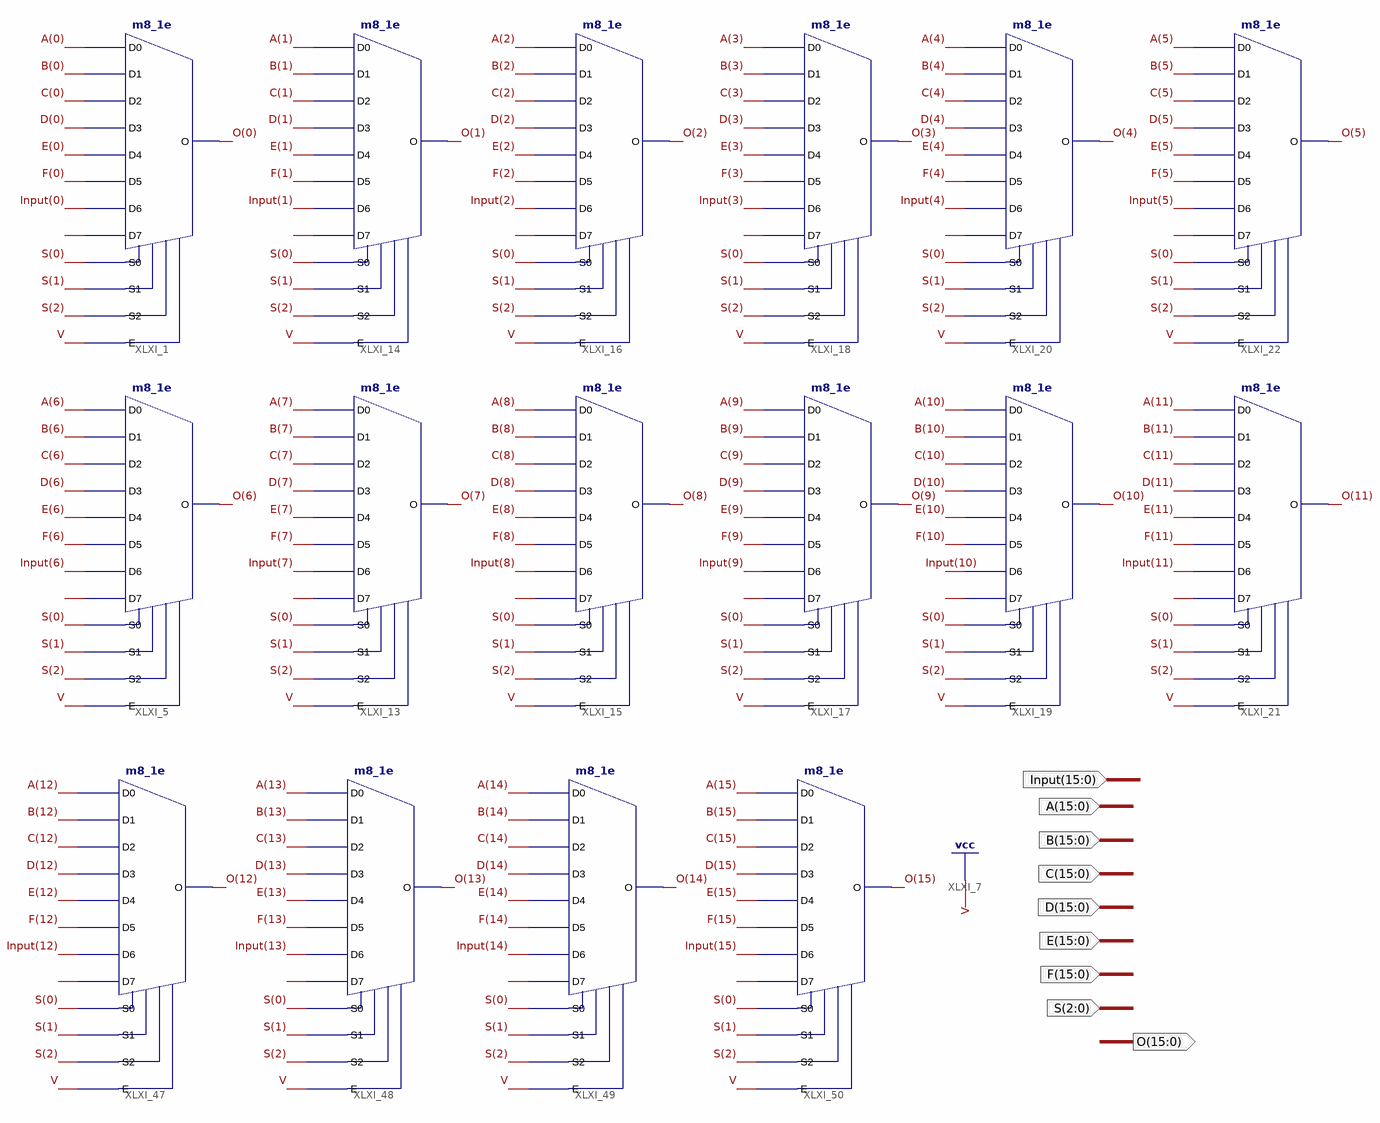
[diagram p0: schematic sheet 1]
// Xilinx ISE schematic mux6input16bit.sch (spartan3adsp) as structural Verilog: 16 symbols, 9 ports
module mux6input16bit (
  input  [15:0] A,
  input  [15:0] B,
  input  [15:0] C,
  input  [15:0] D,
  input  [15:0] E,
  input  [15:0] F,
  input  [2:0] S,
  input  [15:0] Input,
  output [15:0] O
);

  wire XLXN_13, XLXN_86, XLXN_190, XLXN_203, XLXN_216, XLXN_229, XLXN_242, XLXN_255, XLXN_268, XLXN_281,
       XLXN_294, XLXN_307, XLXN_632, XLXN_645, XLXN_658, XLXN_671;

  m8_1e XLXI_5 (
    .D0(A[6]), .D1(B[6]), .D2(C[6]), .D3(D[6]), .D4(E[6]), .D5(F[6]), .D6(Input[6]), .D7(XLXN_86), .E(1'b1),
    .S0(S[0]), .S1(S[1]), .S2(S[2]), .O(O[6]));
  m8_1e XLXI_1 (
    .D0(A[0]), .D1(B[0]), .D2(C[0]), .D3(D[0]), .D4(E[0]), .D5(F[0]), .D6(Input[0]), .D7(XLXN_13), .E(1'b1),
    .S0(S[0]), .S1(S[1]), .S2(S[2]), .O(O[0]));
  m8_1e XLXI_13 (
    .D0(A[7]), .D1(B[7]), .D2(C[7]), .D3(D[7]), .D4(E[7]), .D5(F[7]), .D6(Input[7]), .D7(XLXN_190), .E(1'b1),
    .S0(S[0]), .S1(S[1]), .S2(S[2]), .O(O[7]));
  m8_1e XLXI_14 (
    .D0(A[1]), .D1(B[1]), .D2(C[1]), .D3(D[1]), .D4(E[1]), .D5(F[1]), .D6(Input[1]), .D7(XLXN_203), .E(1'b1),
    .S0(S[0]), .S1(S[1]), .S2(S[2]), .O(O[1]));
  m8_1e XLXI_15 (
    .D0(A[8]), .D1(B[8]), .D2(C[8]), .D3(D[8]), .D4(E[8]), .D5(F[8]), .D6(Input[8]), .D7(XLXN_216), .E(1'b1),
    .S0(S[0]), .S1(S[1]), .S2(S[2]), .O(O[8]));
  m8_1e XLXI_16 (
    .D0(A[2]), .D1(B[2]), .D2(C[2]), .D3(D[2]), .D4(E[2]), .D5(F[2]), .D6(Input[2]), .D7(XLXN_229), .E(1'b1),
    .S0(S[0]), .S1(S[1]), .S2(S[2]), .O(O[2]));
  m8_1e XLXI_17 (
    .D0(A[9]), .D1(B[9]), .D2(C[9]), .D3(D[9]), .D4(E[9]), .D5(F[9]), .D6(Input[9]), .D7(XLXN_242), .E(1'b1),
    .S0(S[0]), .S1(S[1]), .S2(S[2]), .O(O[9]));
  m8_1e XLXI_18 (
    .D0(A[3]), .D1(B[3]), .D2(C[3]), .D3(D[3]), .D4(E[3]), .D5(F[3]), .D6(Input[3]), .D7(XLXN_255), .E(1'b1),
    .S0(S[0]), .S1(S[1]), .S2(S[2]), .O(O[3]));
  m8_1e XLXI_19 (
    .D0(A[10]), .D1(B[10]), .D2(C[10]), .D3(D[10]), .D4(E[10]), .D5(F[10]), .D6(Input[10]), .D7(XLXN_268),
    .E(1'b1), .S0(S[0]), .S1(S[1]), .S2(S[2]), .O(O[10]));
  m8_1e XLXI_20 (
    .D0(A[4]), .D1(B[4]), .D2(C[4]), .D3(D[4]), .D4(E[4]), .D5(F[4]), .D6(Input[4]), .D7(XLXN_281), .E(1'b1),
    .S0(S[0]), .S1(S[1]), .S2(S[2]), .O(O[4]));
  m8_1e XLXI_21 (
    .D0(A[11]), .D1(B[11]), .D2(C[11]), .D3(D[11]), .D4(E[11]), .D5(F[11]), .D6(Input[11]), .D7(XLXN_294),
    .E(1'b1), .S0(S[0]), .S1(S[1]), .S2(S[2]), .O(O[11]));
  m8_1e XLXI_22 (
    .D0(A[5]), .D1(B[5]), .D2(C[5]), .D3(D[5]), .D4(E[5]), .D5(F[5]), .D6(Input[5]), .D7(XLXN_307), .E(1'b1),
    .S0(S[0]), .S1(S[1]), .S2(S[2]), .O(O[5]));
  m8_1e XLXI_47 (
    .D0(A[12]), .D1(B[12]), .D2(C[12]), .D3(D[12]), .D4(E[12]), .D5(F[12]), .D6(Input[12]), .D7(XLXN_632),
    .E(1'b1), .S0(S[0]), .S1(S[1]), .S2(S[2]), .O(O[12]));
  m8_1e XLXI_48 (
    .D0(A[13]), .D1(B[13]), .D2(C[13]), .D3(D[13]), .D4(E[13]), .D5(F[13]), .D6(Input[13]), .D7(XLXN_645),
    .E(1'b1), .S0(S[0]), .S1(S[1]), .S2(S[2]), .O(O[13]));
  m8_1e XLXI_49 (
    .D0(A[14]), .D1(B[14]), .D2(C[14]), .D3(D[14]), .D4(E[14]), .D5(F[14]), .D6(Input[14]), .D7(XLXN_658),
    .E(1'b1), .S0(S[0]), .S1(S[1]), .S2(S[2]), .O(O[14]));
  m8_1e XLXI_50 (
    .D0(A[15]), .D1(B[15]), .D2(C[15]), .D3(D[15]), .D4(E[15]), .D5(F[15]), .D6(Input[15]), .D7(XLXN_671),
    .E(1'b1), .S0(S[0]), .S1(S[1]), .S2(S[2]), .O(O[15]));
endmodule
